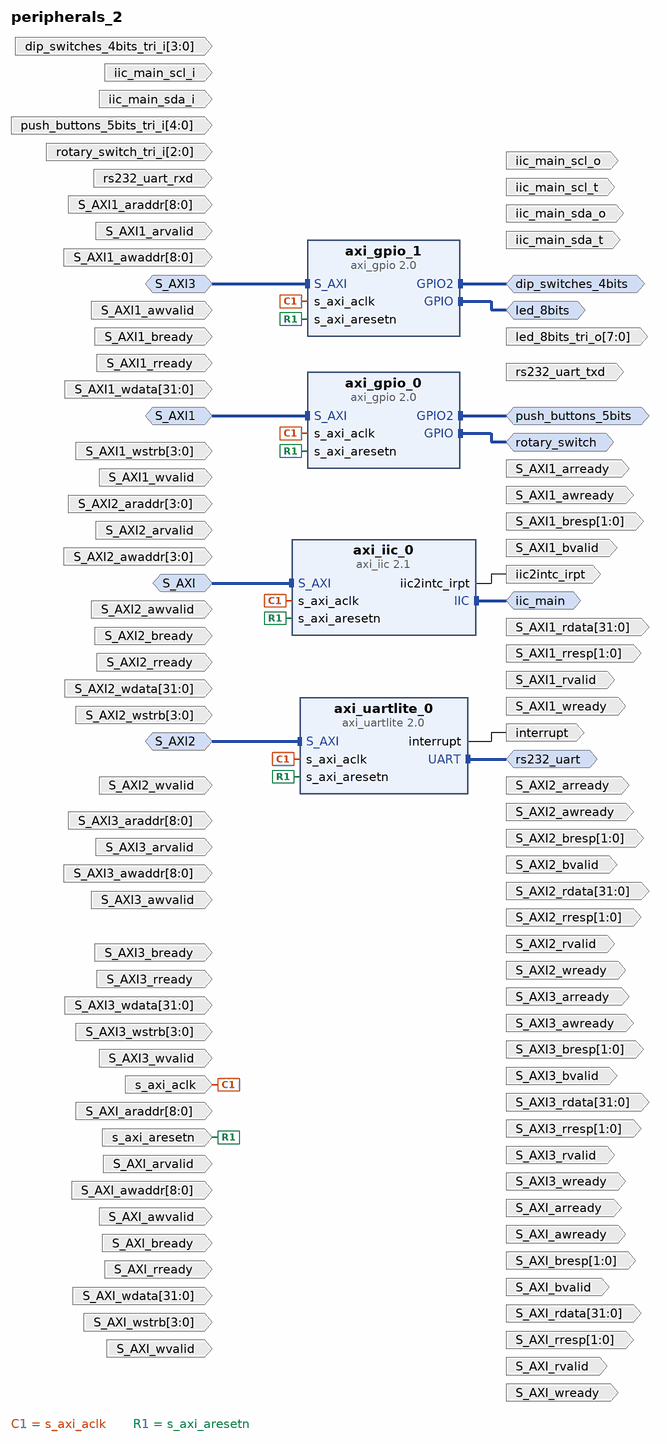
[diagram p0: block diagram of the top level]
# Vivado block design peripherals_2, xcku040-ffva1156-2-e, Vivado 2021.1
create_bd_design peripherals_2

create_bd_intf_port -mode Slave -vlnv xilinx.com:interface:aximm_rtl:1.0 S_AXI
set_property -dict [list \
  CONFIG.ADDR_WIDTH 31 \
  CONFIG.ARUSER_WIDTH 0 \
  CONFIG.AWUSER_WIDTH 0 \
  CONFIG.BUSER_WIDTH 0 \
  CONFIG.DATA_WIDTH 32 \
  CONFIG.HAS_BRESP 1 \
  CONFIG.HAS_BURST 0 \
  CONFIG.HAS_CACHE 0 \
  CONFIG.HAS_LOCK 0 \
  CONFIG.HAS_PROT 0 \
  CONFIG.HAS_QOS 0 \
  CONFIG.HAS_REGION 0 \
  CONFIG.HAS_RRESP 1 \
  CONFIG.HAS_WSTRB 1 \
  CONFIG.ID_WIDTH 0 \
  CONFIG.MAX_BURST_LENGTH 1 \
  CONFIG.NUM_READ_OUTSTANDING 2 \
  CONFIG.NUM_READ_THREADS 1 \
  CONFIG.NUM_WRITE_OUTSTANDING 2 \
  CONFIG.NUM_WRITE_THREADS 1 \
  CONFIG.PROTOCOL AXI4LITE \
  CONFIG.READ_WRITE_MODE READ_WRITE \
  CONFIG.RUSER_BITS_PER_BYTE 0 \
  CONFIG.RUSER_WIDTH 0 \
  CONFIG.SUPPORTS_NARROW_BURST 0 \
  CONFIG.WUSER_BITS_PER_BYTE 0 \
  CONFIG.WUSER_WIDTH 0 \
] [get_bd_intf_ports S_AXI]
create_bd_intf_port -mode Slave -vlnv xilinx.com:interface:aximm_rtl:1.0 S_AXI1
set_property -dict [list \
  CONFIG.ADDR_WIDTH 31 \
  CONFIG.ARUSER_WIDTH 0 \
  CONFIG.AWUSER_WIDTH 0 \
  CONFIG.BUSER_WIDTH 0 \
  CONFIG.DATA_WIDTH 32 \
  CONFIG.HAS_BRESP 1 \
  CONFIG.HAS_BURST 0 \
  CONFIG.HAS_CACHE 0 \
  CONFIG.HAS_LOCK 0 \
  CONFIG.HAS_PROT 0 \
  CONFIG.HAS_QOS 0 \
  CONFIG.HAS_REGION 0 \
  CONFIG.HAS_RRESP 1 \
  CONFIG.HAS_WSTRB 1 \
  CONFIG.ID_WIDTH 0 \
  CONFIG.MAX_BURST_LENGTH 1 \
  CONFIG.NUM_READ_OUTSTANDING 2 \
  CONFIG.NUM_READ_THREADS 1 \
  CONFIG.NUM_WRITE_OUTSTANDING 2 \
  CONFIG.NUM_WRITE_THREADS 1 \
  CONFIG.PROTOCOL AXI4LITE \
  CONFIG.READ_WRITE_MODE READ_WRITE \
  CONFIG.RUSER_BITS_PER_BYTE 0 \
  CONFIG.RUSER_WIDTH 0 \
  CONFIG.SUPPORTS_NARROW_BURST 0 \
  CONFIG.WUSER_BITS_PER_BYTE 0 \
  CONFIG.WUSER_WIDTH 0 \
] [get_bd_intf_ports S_AXI1]
create_bd_intf_port -mode Slave -vlnv xilinx.com:interface:aximm_rtl:1.0 S_AXI2
set_property -dict [list \
  CONFIG.ADDR_WIDTH 31 \
  CONFIG.ARUSER_WIDTH 0 \
  CONFIG.AWUSER_WIDTH 0 \
  CONFIG.BUSER_WIDTH 0 \
  CONFIG.DATA_WIDTH 32 \
  CONFIG.HAS_BRESP 1 \
  CONFIG.HAS_BURST 0 \
  CONFIG.HAS_CACHE 0 \
  CONFIG.HAS_LOCK 0 \
  CONFIG.HAS_PROT 0 \
  CONFIG.HAS_QOS 0 \
  CONFIG.HAS_REGION 0 \
  CONFIG.HAS_RRESP 1 \
  CONFIG.HAS_WSTRB 1 \
  CONFIG.ID_WIDTH 0 \
  CONFIG.MAX_BURST_LENGTH 1 \
  CONFIG.NUM_READ_OUTSTANDING 2 \
  CONFIG.NUM_READ_THREADS 1 \
  CONFIG.NUM_WRITE_OUTSTANDING 2 \
  CONFIG.NUM_WRITE_THREADS 1 \
  CONFIG.PROTOCOL AXI4LITE \
  CONFIG.READ_WRITE_MODE READ_WRITE \
  CONFIG.RUSER_BITS_PER_BYTE 0 \
  CONFIG.RUSER_WIDTH 0 \
  CONFIG.SUPPORTS_NARROW_BURST 0 \
  CONFIG.WUSER_BITS_PER_BYTE 0 \
  CONFIG.WUSER_WIDTH 0 \
] [get_bd_intf_ports S_AXI2]
create_bd_intf_port -mode Slave -vlnv xilinx.com:interface:aximm_rtl:1.0 S_AXI3
set_property -dict [list \
  CONFIG.ADDR_WIDTH 31 \
  CONFIG.ARUSER_WIDTH 0 \
  CONFIG.AWUSER_WIDTH 0 \
  CONFIG.BUSER_WIDTH 0 \
  CONFIG.DATA_WIDTH 32 \
  CONFIG.HAS_BRESP 1 \
  CONFIG.HAS_BURST 0 \
  CONFIG.HAS_CACHE 0 \
  CONFIG.HAS_LOCK 0 \
  CONFIG.HAS_PROT 0 \
  CONFIG.HAS_QOS 0 \
  CONFIG.HAS_REGION 0 \
  CONFIG.HAS_RRESP 1 \
  CONFIG.HAS_WSTRB 1 \
  CONFIG.ID_WIDTH 0 \
  CONFIG.MAX_BURST_LENGTH 1 \
  CONFIG.NUM_READ_OUTSTANDING 2 \
  CONFIG.NUM_READ_THREADS 1 \
  CONFIG.NUM_WRITE_OUTSTANDING 2 \
  CONFIG.NUM_WRITE_THREADS 1 \
  CONFIG.PROTOCOL AXI4LITE \
  CONFIG.READ_WRITE_MODE READ_WRITE \
  CONFIG.RUSER_BITS_PER_BYTE 0 \
  CONFIG.RUSER_WIDTH 0 \
  CONFIG.SUPPORTS_NARROW_BURST 0 \
  CONFIG.WUSER_BITS_PER_BYTE 0 \
  CONFIG.WUSER_WIDTH 0 \
] [get_bd_intf_ports S_AXI3]
create_bd_intf_port -mode Master -vlnv xilinx.com:interface:gpio_rtl:1.0 dip_switches_4bits
create_bd_intf_port -mode Master -vlnv xilinx.com:interface:iic_rtl:1.0 iic_main
create_bd_intf_port -mode Master -vlnv xilinx.com:interface:gpio_rtl:1.0 led_8bits
create_bd_intf_port -mode Master -vlnv xilinx.com:interface:gpio_rtl:1.0 push_buttons_5bits
create_bd_intf_port -mode Master -vlnv xilinx.com:interface:gpio_rtl:1.0 rotary_switch
create_bd_intf_port -mode Master -vlnv xilinx.com:interface:uart_rtl:1.0 rs232_uart
create_bd_port -dir O -type intr iic2intc_irpt
create_bd_port -dir O -type intr interrupt
create_bd_port -dir I -type clk s_axi_aclk
set_property -dict [list \
  CONFIG.ASSOCIATED_BUSIF S_AXI:S_AXI2:S_AXI3:S_AXI1 \
  CONFIG.ASSOCIATED_RESET s_axi_aresetn \
] [get_bd_ports s_axi_aclk]
create_bd_port -dir I -type rst s_axi_aresetn
create_bd_port -dir I -from 8 -to 0 S_AXI_araddr
create_bd_port -dir O S_AXI_arready
create_bd_port -dir I S_AXI_arvalid
create_bd_port -dir I -from 8 -to 0 S_AXI_awaddr
create_bd_port -dir O S_AXI_awready
create_bd_port -dir I S_AXI_awvalid
create_bd_port -dir I S_AXI_bready
create_bd_port -dir O -from 1 -to 0 S_AXI_bresp
create_bd_port -dir O S_AXI_bvalid
create_bd_port -dir O -from 31 -to 0 S_AXI_rdata
create_bd_port -dir I S_AXI_rready
create_bd_port -dir O -from 1 -to 0 S_AXI_rresp
create_bd_port -dir O S_AXI_rvalid
create_bd_port -dir I -from 31 -to 0 S_AXI_wdata
create_bd_port -dir O S_AXI_wready
create_bd_port -dir I -from 3 -to 0 S_AXI_wstrb
create_bd_port -dir I S_AXI_wvalid
create_bd_port -dir I -from 8 -to 0 S_AXI1_araddr
create_bd_port -dir O S_AXI1_arready
create_bd_port -dir I S_AXI1_arvalid
create_bd_port -dir I -from 8 -to 0 S_AXI1_awaddr
create_bd_port -dir O S_AXI1_awready
create_bd_port -dir I S_AXI1_awvalid
create_bd_port -dir I S_AXI1_bready
create_bd_port -dir O -from 1 -to 0 S_AXI1_bresp
create_bd_port -dir O S_AXI1_bvalid
create_bd_port -dir O -from 31 -to 0 S_AXI1_rdata
create_bd_port -dir I S_AXI1_rready
create_bd_port -dir O -from 1 -to 0 S_AXI1_rresp
create_bd_port -dir O S_AXI1_rvalid
create_bd_port -dir I -from 31 -to 0 S_AXI1_wdata
create_bd_port -dir O S_AXI1_wready
create_bd_port -dir I -from 3 -to 0 S_AXI1_wstrb
create_bd_port -dir I S_AXI1_wvalid
create_bd_port -dir I -from 3 -to 0 S_AXI2_araddr
create_bd_port -dir O S_AXI2_arready
create_bd_port -dir I S_AXI2_arvalid
create_bd_port -dir I -from 3 -to 0 S_AXI2_awaddr
create_bd_port -dir O S_AXI2_awready
create_bd_port -dir I S_AXI2_awvalid
create_bd_port -dir I S_AXI2_bready
create_bd_port -dir O -from 1 -to 0 S_AXI2_bresp
create_bd_port -dir O S_AXI2_bvalid
create_bd_port -dir O -from 31 -to 0 S_AXI2_rdata
create_bd_port -dir I S_AXI2_rready
create_bd_port -dir O -from 1 -to 0 S_AXI2_rresp
create_bd_port -dir O S_AXI2_rvalid
create_bd_port -dir I -from 31 -to 0 S_AXI2_wdata
create_bd_port -dir O S_AXI2_wready
create_bd_port -dir I -from 3 -to 0 S_AXI2_wstrb
create_bd_port -dir I S_AXI2_wvalid
create_bd_port -dir I -from 8 -to 0 S_AXI3_araddr
create_bd_port -dir O S_AXI3_arready
create_bd_port -dir I S_AXI3_arvalid
create_bd_port -dir I -from 8 -to 0 S_AXI3_awaddr
create_bd_port -dir O S_AXI3_awready
create_bd_port -dir I S_AXI3_awvalid
create_bd_port -dir I S_AXI3_bready
create_bd_port -dir O -from 1 -to 0 S_AXI3_bresp
create_bd_port -dir O S_AXI3_bvalid
create_bd_port -dir O -from 31 -to 0 S_AXI3_rdata
create_bd_port -dir I S_AXI3_rready
create_bd_port -dir O -from 1 -to 0 S_AXI3_rresp
create_bd_port -dir O S_AXI3_rvalid
create_bd_port -dir I -from 31 -to 0 S_AXI3_wdata
create_bd_port -dir O S_AXI3_wready
create_bd_port -dir I -from 3 -to 0 S_AXI3_wstrb
create_bd_port -dir I S_AXI3_wvalid
create_bd_port -dir I -from 3 -to 0 dip_switches_4bits_tri_i
create_bd_port -dir I iic_main_scl_i
create_bd_port -dir O iic_main_scl_o
create_bd_port -dir O iic_main_scl_t
create_bd_port -dir I iic_main_sda_i
create_bd_port -dir O iic_main_sda_o
create_bd_port -dir O iic_main_sda_t
create_bd_port -dir O -from 7 -to 0 led_8bits_tri_o
create_bd_port -dir I -from 4 -to 0 push_buttons_5bits_tri_i
create_bd_port -dir I -from 2 -to 0 rotary_switch_tri_i
create_bd_port -dir I rs232_uart_rxd
create_bd_port -dir O rs232_uart_txd

create_bd_cell -type ip -vlnv xilinx.com:ip:axi_gpio:2.0 axi_gpio_0
set_property -dict [list \
  CONFIG.GPIO2_BOARD_INTERFACE push_buttons_5bits \
  CONFIG.GPIO_BOARD_INTERFACE rotary_switch \
  CONFIG.USE_BOARD_FLOW true \
] [get_bd_cells axi_gpio_0]
create_bd_cell -type ip -vlnv xilinx.com:ip:axi_gpio:2.0 axi_gpio_1
set_property -dict [list \
  CONFIG.GPIO2_BOARD_INTERFACE dip_switches_4bits \
  CONFIG.GPIO_BOARD_INTERFACE led_8bits \
  CONFIG.USE_BOARD_FLOW true \
] [get_bd_cells axi_gpio_1]
create_bd_cell -type ip -vlnv xilinx.com:ip:axi_iic:2.1 axi_iic_0
set_property -dict {CONFIG.IIC_BOARD_INTERFACE iic_main CONFIG.USE_BOARD_FLOW true} [get_bd_cells axi_iic_0]
create_bd_cell -type ip -vlnv xilinx.com:ip:axi_uartlite:2.0 axi_uartlite_0
set_property -dict {CONFIG.UARTLITE_BOARD_INTERFACE rs232_uart CONFIG.USE_BOARD_FLOW true} [get_bd_cells axi_uartlite_0]

# ---- connections ----

connect_bd_intf_net [get_bd_intf_ports rotary_switch] [get_bd_intf_pins axi_gpio_0/GPIO]
connect_bd_intf_net [get_bd_intf_ports push_buttons_5bits] [get_bd_intf_pins axi_gpio_0/GPIO2]
connect_bd_intf_net [get_bd_intf_ports led_8bits] [get_bd_intf_pins axi_gpio_1/GPIO]
connect_bd_intf_net [get_bd_intf_ports dip_switches_4bits] [get_bd_intf_pins axi_gpio_1/GPIO2]
connect_bd_intf_net [get_bd_intf_ports iic_main] [get_bd_intf_pins axi_iic_0/IIC]
connect_bd_intf_net -intf_net axi_interconnect_0_M00_AXI [get_bd_intf_ports S_AXI1] [get_bd_intf_pins axi_gpio_0/S_AXI]
connect_bd_intf_net -intf_net axi_interconnect_0_M01_AXI [get_bd_intf_ports S_AXI2] [get_bd_intf_pins axi_uartlite_0/S_AXI]
connect_bd_intf_net -intf_net axi_interconnect_0_M03_AXI [get_bd_intf_ports S_AXI3] [get_bd_intf_pins axi_gpio_1/S_AXI]
connect_bd_intf_net -intf_net axi_interconnect_0_M04_AXI [get_bd_intf_ports S_AXI] [get_bd_intf_pins axi_iic_0/S_AXI]
connect_bd_intf_net [get_bd_intf_ports rs232_uart] [get_bd_intf_pins axi_uartlite_0/UART]
connect_bd_net [get_bd_pins axi_iic_0/iic2intc_irpt] [get_bd_ports iic2intc_irpt]
connect_bd_net [get_bd_pins axi_uartlite_0/interrupt] [get_bd_ports interrupt]
connect_bd_net -net microblaze_0_Clk [get_bd_ports s_axi_aclk] \
  [get_bd_pins axi_gpio_0/s_axi_aclk] [get_bd_pins axi_gpio_1/s_axi_aclk] [get_bd_pins axi_uartlite_0/s_axi_aclk] \
  [get_bd_pins axi_iic_0/s_axi_aclk]
connect_bd_net -net rst_clk_wiz_1_100M_peripheral_aresetn [get_bd_ports s_axi_aresetn] \
  [get_bd_pins axi_gpio_0/s_axi_aresetn] [get_bd_pins axi_gpio_1/s_axi_aresetn] [get_bd_pins axi_uartlite_0/s_axi_aresetn] \
  [get_bd_pins axi_iic_0/s_axi_aresetn]

# ---- address map ----
assign_bd_address -offset 0x40800000 -range 64K -target_address_space [get_bd_addr_spaces S_AXI] [get_bd_addr_segs axi_iic_0/S_AXI/Reg]
assign_bd_address -offset 0x40000000 -range 64K -target_address_space [get_bd_addr_spaces S_AXI1] [get_bd_addr_segs axi_gpio_0/S_AXI/Reg]
assign_bd_address -offset 0x40600000 -range 64K -target_address_space [get_bd_addr_spaces S_AXI2] [get_bd_addr_segs axi_uartlite_0/S_AXI/Reg]
assign_bd_address -offset 0x40010000 -range 64K -target_address_space [get_bd_addr_spaces S_AXI3] [get_bd_addr_segs axi_gpio_1/S_AXI/Reg]

validate_bd_design
save_bd_design
